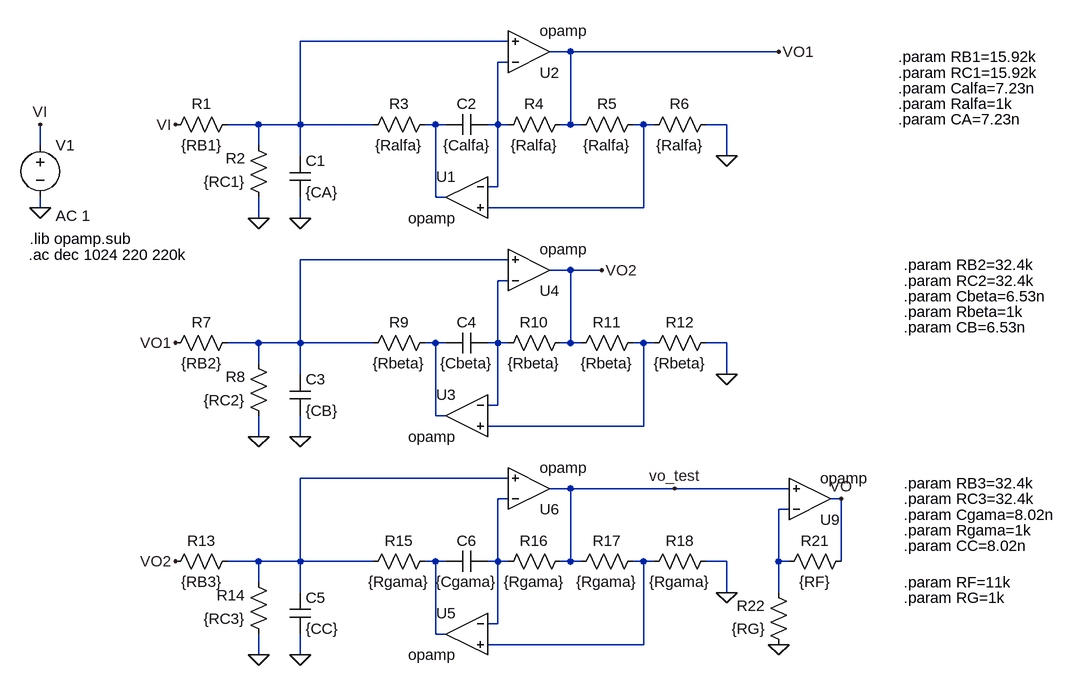
[diagram p0: schematic Activado.asc]
Activado.asc, the LTspice schematic file:
Version 4
SHEET 1 1308 936
WIRE 448 -48 128 -48
WIRE 544 -32 512 -32
WIRE 864 -32 544 -32
WIRE 448 -16 432 -16
WIRE 64 80 16 80
WIRE 128 80 128 -48
WIRE 128 80 64 80
WIRE 240 80 128 80
WIRE 336 80 320 80
WIRE 352 80 336 80
WIRE 432 80 432 -16
WIRE 432 80 416 80
WIRE 448 80 432 80
WIRE 544 80 544 -32
WIRE 544 80 528 80
WIRE 560 80 544 80
WIRE 656 80 640 80
WIRE 672 80 656 80
WIRE 784 80 752 80
WIRE -272 112 -272 80
WIRE 64 112 64 80
WIRE 128 128 128 80
WIRE 784 128 784 80
WIRE 432 176 432 80
WIRE 432 176 416 176
WIRE 336 192 336 80
WIRE 352 192 336 192
WIRE -272 208 -272 192
WIRE 656 208 656 80
WIRE 656 208 416 208
WIRE 64 224 64 192
WIRE 128 224 128 192
WIRE 448 288 128 288
WIRE 544 304 512 304
WIRE 592 304 544 304
WIRE 448 320 432 320
WIRE 64 416 16 416
WIRE 128 416 128 288
WIRE 128 416 64 416
WIRE 240 416 128 416
WIRE 336 416 320 416
WIRE 352 416 336 416
WIRE 432 416 432 320
WIRE 432 416 416 416
WIRE 448 416 432 416
WIRE 544 416 544 304
WIRE 544 416 528 416
WIRE 560 416 544 416
WIRE 656 416 640 416
WIRE 672 416 656 416
WIRE 784 416 752 416
WIRE 64 448 64 416
WIRE 128 464 128 416
WIRE 784 464 784 416
WIRE 432 512 432 416
WIRE 432 512 416 512
WIRE 336 528 336 416
WIRE 352 528 336 528
WIRE 656 544 656 416
WIRE 656 544 416 544
WIRE 64 560 64 528
WIRE 128 560 128 528
WIRE 448 624 128 624
WIRE 544 640 512 640
WIRE 704 640 544 640
WIRE 880 640 704 640
WIRE 448 656 432 656
WIRE 960 656 944 656
WIRE 880 672 864 672
WIRE 64 752 16 752
WIRE 128 752 128 624
WIRE 128 752 64 752
WIRE 240 752 128 752
WIRE 336 752 320 752
WIRE 352 752 336 752
WIRE 432 752 432 656
WIRE 432 752 416 752
WIRE 448 752 432 752
WIRE 544 752 544 640
WIRE 544 752 528 752
WIRE 560 752 544 752
WIRE 656 752 640 752
WIRE 672 752 656 752
WIRE 784 752 752 752
WIRE 864 752 864 672
WIRE 880 752 864 752
WIRE 960 752 960 656
WIRE 64 784 64 752
WIRE 128 800 128 752
WIRE 784 800 784 752
WIRE 864 800 864 752
WIRE 432 848 432 752
WIRE 432 848 416 848
WIRE 336 864 336 752
WIRE 352 864 336 864
WIRE 656 880 656 752
WIRE 656 880 416 880
WIRE 64 896 64 864
WIRE 128 896 128 864
FLAG 64 224 0
FLAG 128 224 0
FLAG 784 128 0
FLAG 64 560 0
FLAG 128 560 0
FLAG 784 464 0
FLAG 64 896 0
FLAG 128 896 0
FLAG 784 800 0
FLAG 864 -32 VO1
FLAG -64 416 VO1
FLAG -64 752 VO2
FLAG 864 880 0
FLAG 960 656 VO
FLAG -272 208 0
FLAG -272 80 VI
FLAG -64 80 VI
FLAG 592 304 VO2
FLAG 704 640 vo_test
SYMBOL res 32 64 R90
WINDOW 0 0 56 VBottom 2
WINDOW 3 32 56 VTop 2
SYMATTR InstName R1
SYMATTR Value {RB1}
SYMBOL res 80 208 R180
WINDOW 0 36 76 Left 2
WINDOW 3 36 40 Left 2
SYMATTR InstName R2
SYMATTR Value {RC1}
SYMBOL cap 112 128 R0
SYMATTR InstName C1
SYMATTR Value {CA}
SYMBOL res 336 64 R90
WINDOW 0 0 56 VBottom 2
WINDOW 3 32 56 VTop 2
SYMATTR InstName R3
SYMATTR Value {Ralfa}
SYMBOL cap 416 64 R90
WINDOW 0 0 32 VBottom 2
WINDOW 3 32 32 VTop 2
SYMATTR InstName C2
SYMATTR Value {Calfa}
SYMBOL res 544 64 R90
WINDOW 0 0 56 VBottom 2
WINDOW 3 32 56 VTop 2
SYMATTR InstName R4
SYMATTR Value {Ralfa}
SYMBOL res 656 64 R90
WINDOW 0 0 56 VBottom 2
WINDOW 3 32 56 VTop 2
SYMATTR InstName R5
SYMATTR Value {Ralfa}
SYMBOL res 768 64 R90
WINDOW 0 0 56 VBottom 2
WINDOW 3 32 56 VTop 2
SYMATTR InstName R6
SYMATTR Value {Ralfa}
SYMBOL OpAmps\\opamp 384 128 M0
SYMATTR InstName U1
SYMBOL OpAmps\\opamp 480 32 M180
SYMATTR InstName U2
SYMBOL res 32 400 R90
WINDOW 0 0 56 VBottom 2
WINDOW 3 32 56 VTop 2
SYMATTR InstName R7
SYMATTR Value {RB2}
SYMBOL res 80 544 R180
WINDOW 0 36 76 Left 2
WINDOW 3 36 40 Left 2
SYMATTR InstName R8
SYMATTR Value {RC2}
SYMBOL cap 112 464 R0
SYMATTR InstName C3
SYMATTR Value {CB}
SYMBOL res 336 400 R90
WINDOW 0 0 56 VBottom 2
WINDOW 3 32 56 VTop 2
SYMATTR InstName R9
SYMATTR Value {Rbeta}
SYMBOL cap 416 400 R90
WINDOW 0 0 32 VBottom 2
WINDOW 3 32 32 VTop 2
SYMATTR InstName C4
SYMATTR Value {Cbeta}
SYMBOL res 544 400 R90
WINDOW 0 0 56 VBottom 2
WINDOW 3 32 56 VTop 2
SYMATTR InstName R10
SYMATTR Value {Rbeta}
SYMBOL res 656 400 R90
WINDOW 0 0 56 VBottom 2
WINDOW 3 32 56 VTop 2
SYMATTR InstName R11
SYMATTR Value {Rbeta}
SYMBOL res 768 400 R90
WINDOW 0 0 56 VBottom 2
WINDOW 3 32 56 VTop 2
SYMATTR InstName R12
SYMATTR Value {Rbeta}
SYMBOL OpAmps\\opamp 384 464 M0
SYMATTR InstName U3
SYMBOL OpAmps\\opamp 480 368 M180
SYMATTR InstName U4
SYMBOL res 32 736 R90
WINDOW 0 0 56 VBottom 2
WINDOW 3 32 56 VTop 2
SYMATTR InstName R13
SYMATTR Value {RB3}
SYMBOL res 80 880 R180
WINDOW 0 36 76 Left 2
WINDOW 3 36 40 Left 2
SYMATTR InstName R14
SYMATTR Value {RC3}
SYMBOL cap 112 800 R0
SYMATTR InstName C5
SYMATTR Value {CC}
SYMBOL res 336 736 R90
WINDOW 0 0 56 VBottom 2
WINDOW 3 32 56 VTop 2
SYMATTR InstName R15
SYMATTR Value {Rgama}
SYMBOL cap 416 736 R90
WINDOW 0 0 32 VBottom 2
WINDOW 3 32 32 VTop 2
SYMATTR InstName C6
SYMATTR Value {Cgama}
SYMBOL res 544 736 R90
WINDOW 0 0 56 VBottom 2
WINDOW 3 32 56 VTop 2
SYMATTR InstName R16
SYMATTR Value {Rgama}
SYMBOL res 656 736 R90
WINDOW 0 0 56 VBottom 2
WINDOW 3 32 56 VTop 2
SYMATTR InstName R17
SYMATTR Value {Rgama}
SYMBOL res 768 736 R90
WINDOW 0 0 56 VBottom 2
WINDOW 3 32 56 VTop 2
SYMATTR InstName R18
SYMATTR Value {Rgama}
SYMBOL OpAmps\\opamp 384 800 M0
SYMATTR InstName U5
SYMBOL OpAmps\\opamp 480 704 M180
SYMATTR InstName U6
SYMBOL OpAmps\\opamp 912 720 M180
SYMATTR InstName U9
SYMBOL res 976 736 R90
WINDOW 0 0 56 VBottom 2
WINDOW 3 32 56 VTop 2
SYMATTR InstName R21
SYMATTR Value {RF}
SYMBOL res 880 896 R180
WINDOW 0 36 76 Left 2
WINDOW 3 36 40 Left 2
SYMATTR InstName R22
SYMATTR Value {RG}
SYMBOL voltage -272 96 R0
WINDOW 123 24 124 Left 2
WINDOW 39 0 0 Left 0
SYMATTR InstName V1
SYMATTR Value ""
SYMATTR Value2 AC 1
TEXT -288 256 Left 2 !.lib opamp.sub
TEXT 1048 -24 Left 2 !.param RB1=15.92k
TEXT 1048 0 Left 2 !.param RC1=15.92k
TEXT 1048 24 Left 2 !.param Calfa=7.23n
TEXT 1048 48 Left 2 !.param Ralfa=1k
TEXT 1056 296 Left 2 !.param RB2=32.4k
TEXT 1056 320 Left 2 !.param RC2=32.4k
TEXT 1056 344 Left 2 !.param Cbeta=6.53n
TEXT 1056 368 Left 2 !.param Rbeta=1k
TEXT 1056 632 Left 2 !.param RB3=32.4k
TEXT 1056 656 Left 2 !.param RC3=32.4k
TEXT 1056 680 Left 2 !.param Cgama=8.02n
TEXT 1056 704 Left 2 !.param Rgama=1k
TEXT 1048 72 Left 2 !.param CA=7.23n
TEXT 1056 392 Left 2 !.param CB=6.53n
TEXT 1056 728 Left 2 !.param CC=8.02n
TEXT 1056 784 Left 2 !.param RF=11k
TEXT 1056 808 Left 2 !.param RG=1k
TEXT -290 280 Left 2 !.ac dec 1024 220 220k

The netlist it stands for:
* Activado.asc
R1 N001 VI {RB1}
R2 0 N001 {RC1}
C1 N001 0 {CA}
R3 N003 N001 {Ralfa}
C2 N002 N003 {Calfa}
R4 VO1 N002 {Ralfa}
R5 N004 VO1 {Ralfa}
R6 0 N004 {Ralfa}
XU1 N002 N004 N003 opamp Aol=100K GBW=10Meg  ; pins invin noninvin out
XU2 N002 N001 VO1 opamp Aol=100K GBW=10Meg  ; pins invin noninvin out
R7 N005 VO1 {RB2}
R8 0 N005 {RC2}
C3 N005 0 {CB}
R9 N007 N005 {Rbeta}
C4 N006 N007 {Cbeta}
R10 VO2 N006 {Rbeta}
R11 N008 VO2 {Rbeta}
R12 0 N008 {Rbeta}
XU3 N006 N008 N007 opamp Aol=100K GBW=10Meg  ; pins invin noninvin out
XU4 N006 N005 VO2 opamp Aol=100K GBW=10Meg  ; pins invin noninvin out
R13 N009 VO2 {RB3}
R14 0 N009 {RC3}
C5 N009 0 {CC}
R15 N012 N009 {Rgama}
C6 N010 N012 {Cgama}
R16 vo_test N010 {Rgama}
R17 N013 vo_test {Rgama}
R18 0 N013 {Rgama}
XU5 N010 N013 N012 opamp Aol=100K GBW=10Meg  ; pins invin noninvin out
XU6 N010 N009 vo_test opamp Aol=100K GBW=10Meg  ; pins invin noninvin out
XU9 N011 vo_test VO opamp Aol=100K GBW=10Meg  ; pins invin noninvin out
R21 VO N011 {RF}
R22 0 N011 {RG}
V1 VI 0 AC 1
.lib opamp.sub
.param RB1=15.92k
.param RC1=15.92k
.param Calfa=7.23n
.param Ralfa=1k
.param RB2=32.4k
.param RC2=32.4k
.param Cbeta=6.53n
.param Rbeta=1k
.param RB3=32.4k
.param RC3=32.4k
.param Cgama=8.02n
.param Rgama=1k
.param CA=7.23n
.param CB=6.53n
.param CC=8.02n
.param RF=11k
.param RG=1k
.ac dec 1024 220 220k
.backanno
.end

* Results of the author's LTspice run, read from the files saved beside the schematic
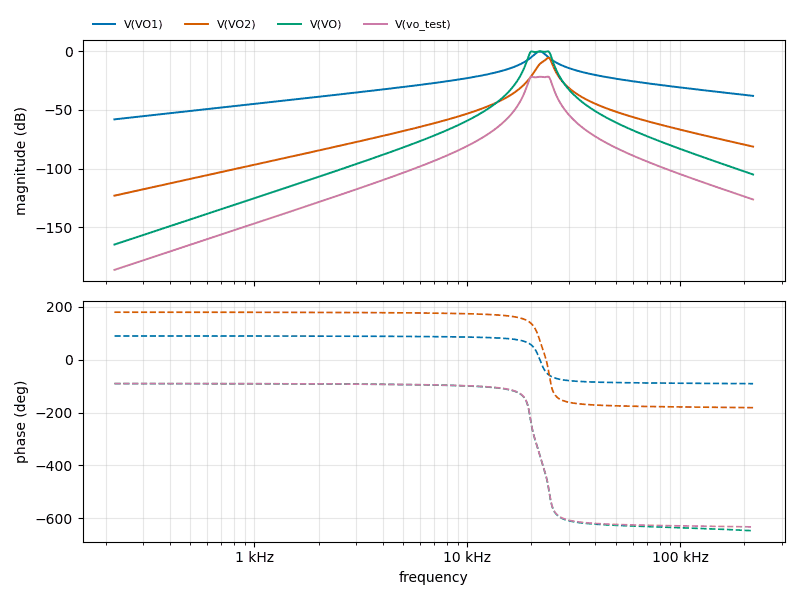
[diagram p1: AC Analysis of Activado.asc, plotted from the saved traces]
* AC Analysis, 1 run:
*   V(VO1): -58.00 dB at 220 Hz, -37.98 dB at 220 kHz, peak -0.02 dB at 21.9 kHz, 3 dB below the peak at 20.58 kHz and 23.34 kHz
*   V(VO2): -123.06 dB at 220 Hz, -81.24 dB at 220 kHz, peak -5.40 dB at 24.07 kHz, 3 dB below the peak at 22.84 kHz and 24.75 kHz
*   V(VO): -164.76 dB at 220 Hz, -105.01 dB at 220 kHz, peak 0.04 dB at 23.91 kHz, 3 dB below the peak at 19.49 kHz and 24.61 kHz
*   V(vo_test): -186.34 dB at 220 Hz, -126.30 dB at 220 kHz, peak -21.54 dB at 23.91 kHz, 3 dB below the peak at 19.49 kHz and 24.61 kHz